# EAGLE board Hornet UFC 020a (EAGLE 9.2.2)
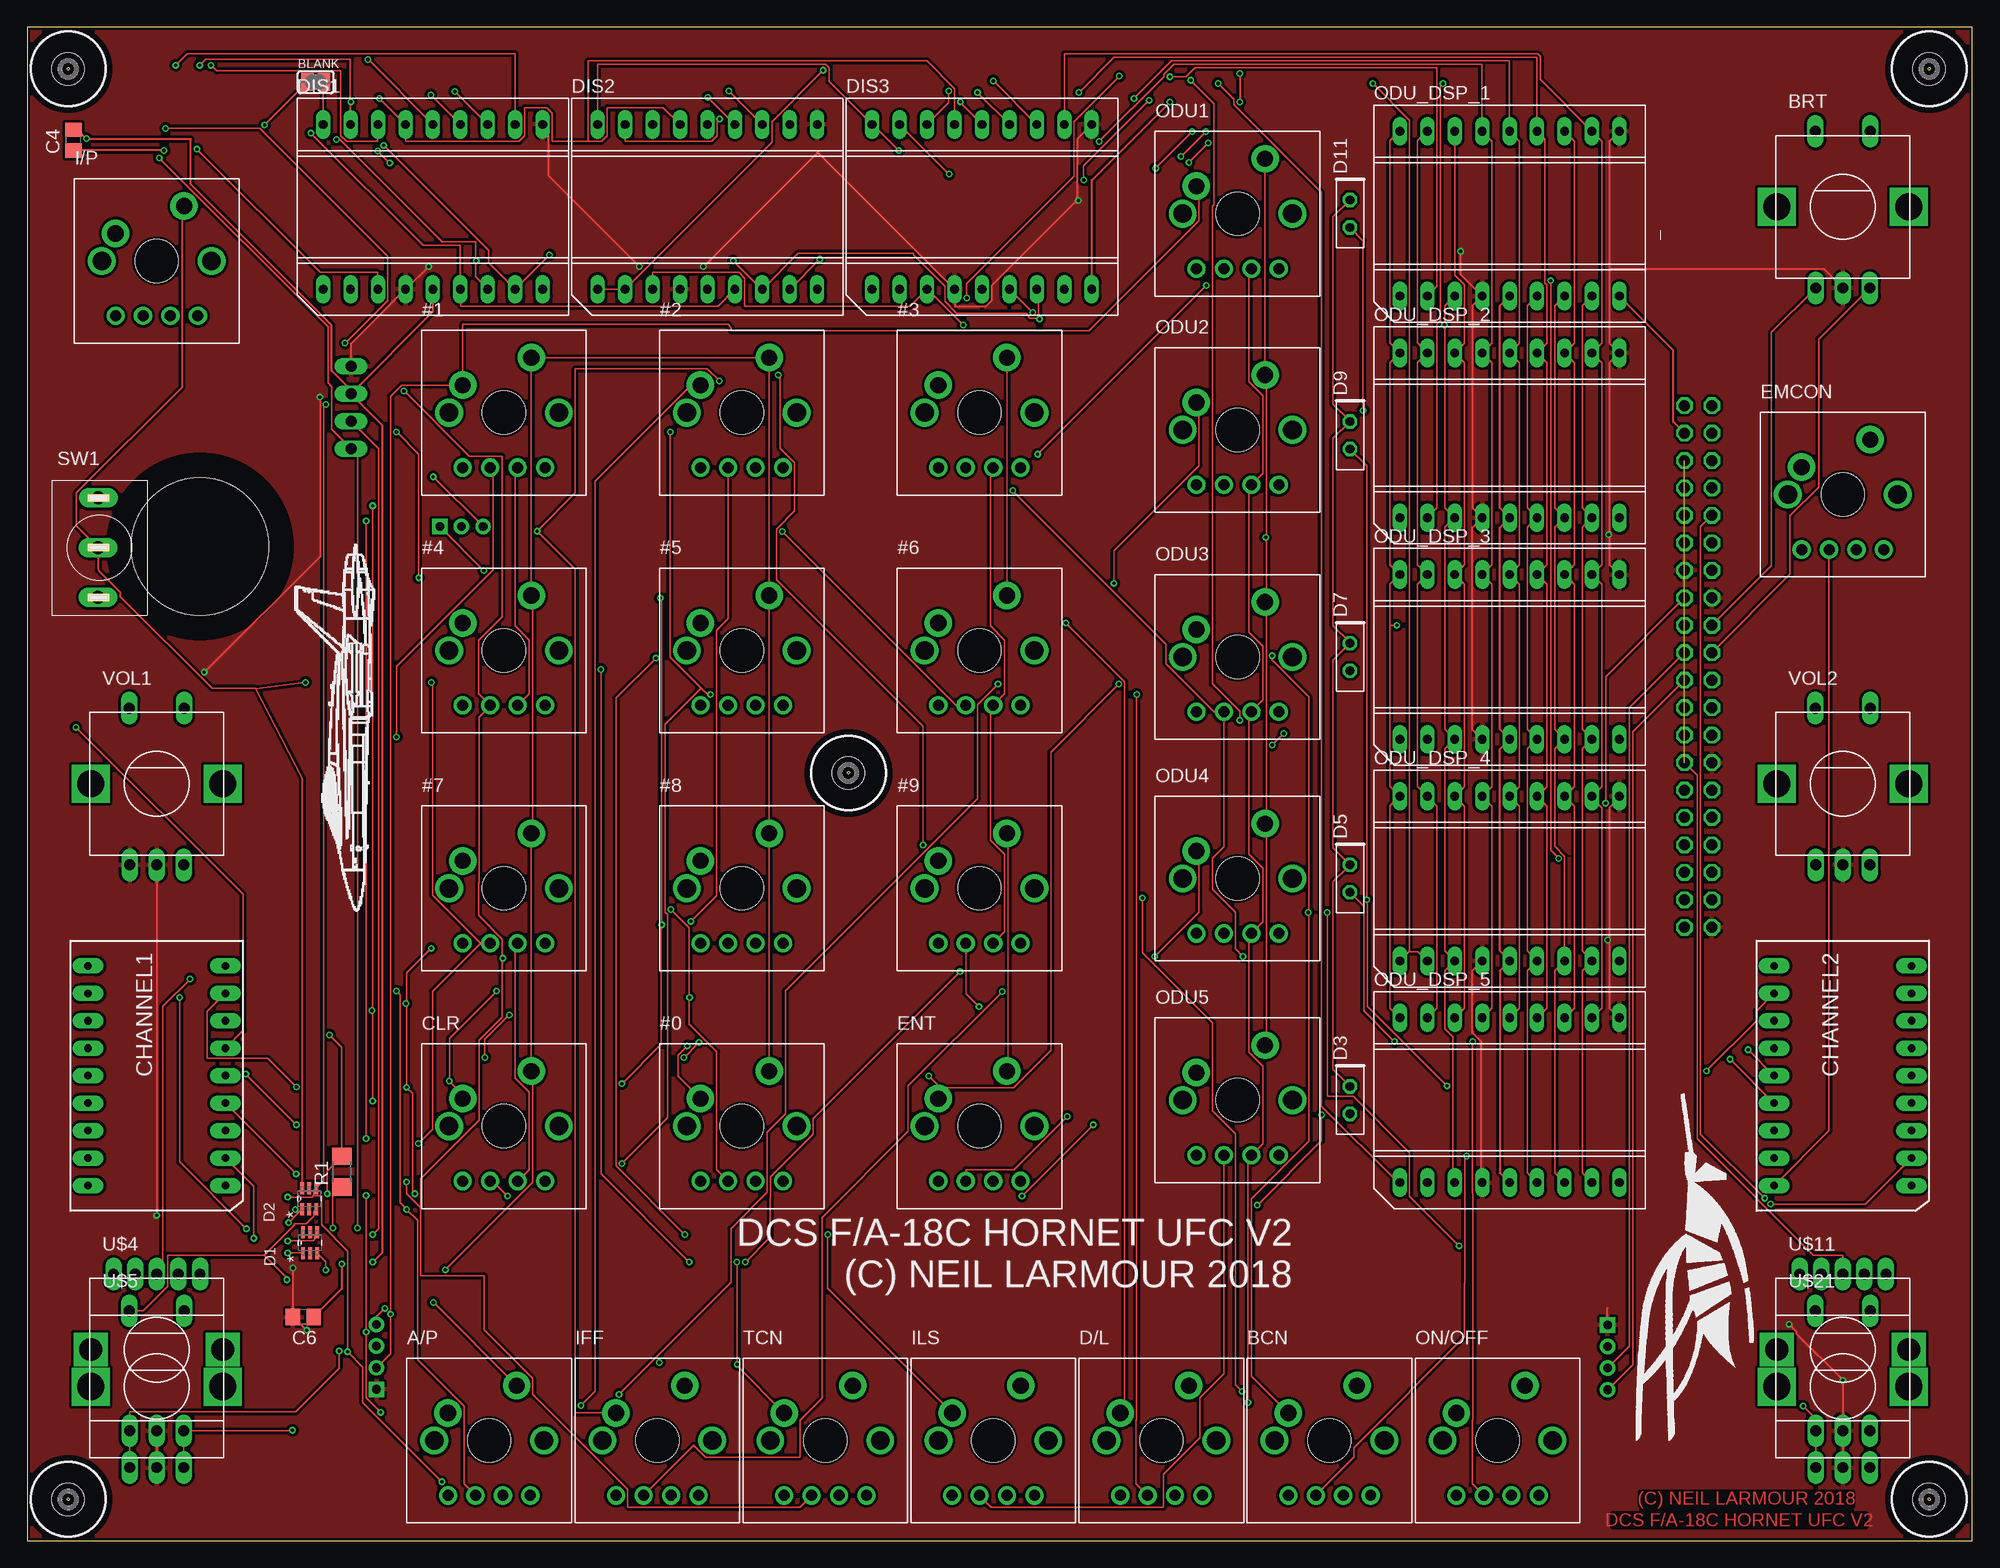
[diagram p7: board, top side]
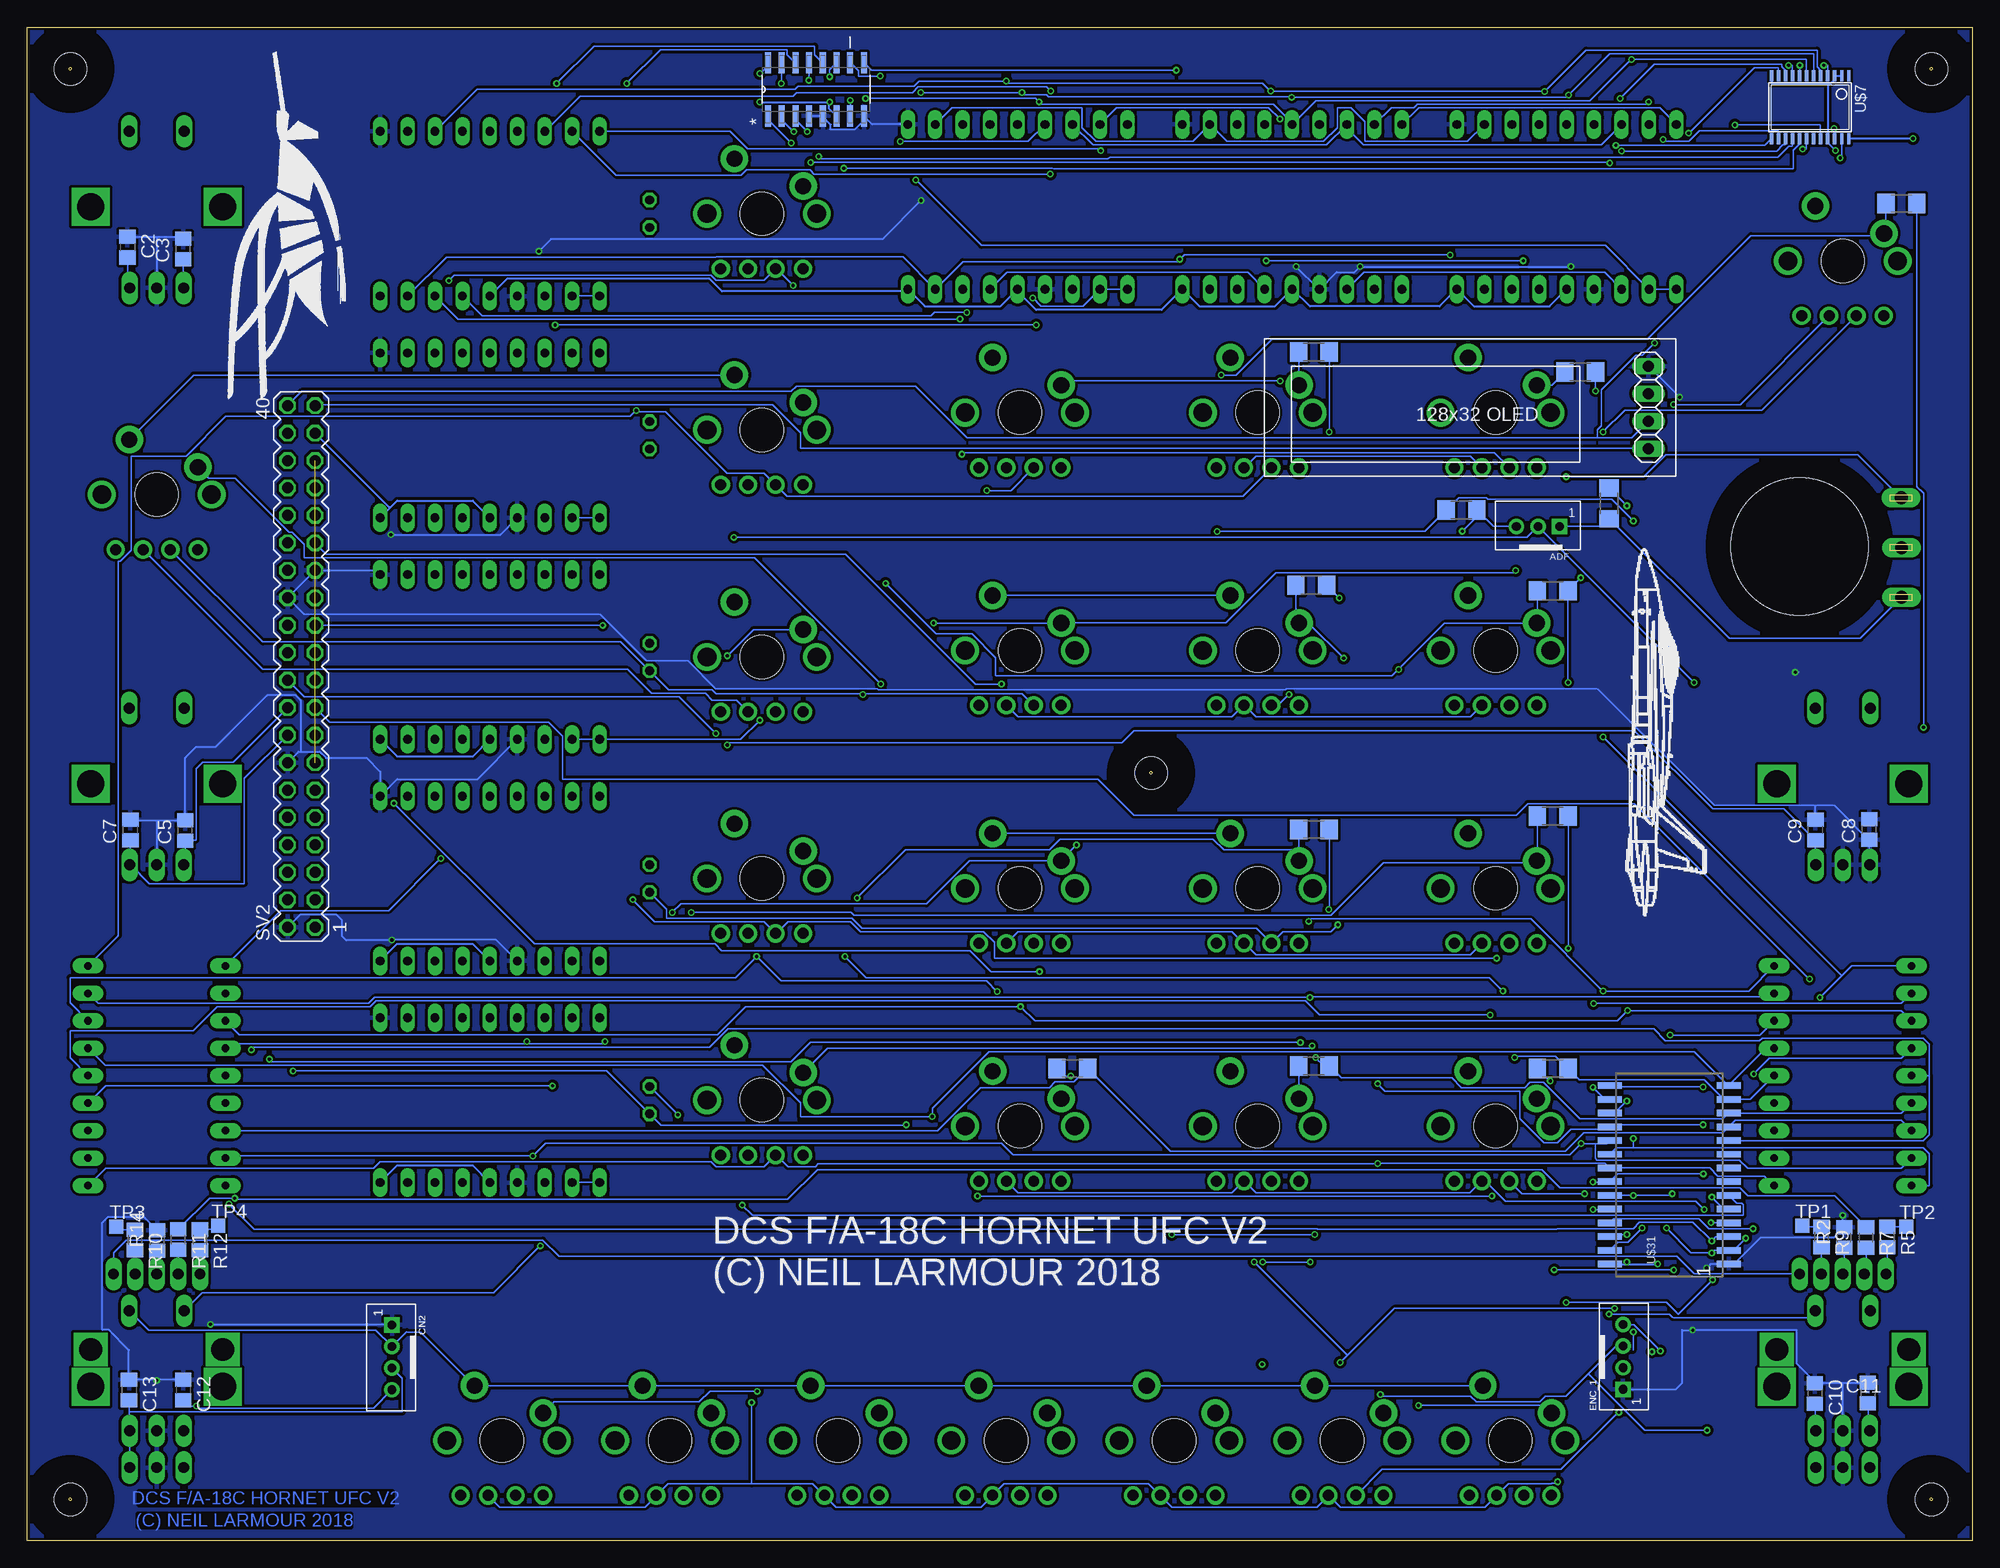
[diagram p8: board, bottom side, seen from below]

Size 180 x 140 mm. Coordinates in mm from the lower left corner, seen from the top.
Outline: 0,0 180,0 180,140 0,140 0,0
Copper layers (1*16): Top 0.035mm / dielectric 1.5mm / Bottom 0.035mm
Design rules "SeeedStudio_2layer_DRU_no_angle_20140221": minimum track width 6mil, minimum drill 12mil, track to track 6mil, track to pad 6mil, pad to pad 6mil, via to via 6mil, smd to smd 0mil, copper to edge 10mil, drill to drill 10mil, minimum pad ring 10mil, minimum via ring 6mil, stop-mask expansion 2mil, vias tented up to drill 100mil, thermal gap 10mil
Net classes: 1 power: width 0.2 mm
Holes 12.7 mm at 16,91.95
tKeepout: area 8.6,84.5 to 23.4,99.4
bKeepout: area 8.6,84.5 to 23.4,99.4
tRestrict: area 8.6,84.5 to 23.4,99.4
bRestrict: area 8.6,84.5 to 23.4,99.4

## Footprints (pad centres in the part's own frame; a part is rotated, then mirrored left to right if it is on the bottom)
SOIC127P600X175-16N = smd 1.981 x 0.559: 1 -2.464,4.445; 2 -2.464,3.175; 3 -2.464,1.905; 4 -2.464,0.635; 5 -2.464,-0.635; 6 -2.464,-1.905; 7 -2.464,-3.175; 8 -2.464,-4.445; 9 2.464,-4.445; 10 2.464,-3.175; 11 2.464,-1.905; 12 2.464,-0.635; 13 2.464,0.635; 14 2.464,1.905; 15 2.464,3.175; 16 2.464,4.445
GATERON-LED = drill 1.016 pad 1.676: LED1 -3.81,-5.08; LED2 3.81,-5.08; LED_ANODE -1.27,-5.08; LED_CATHODE 1.27,-5.08 | drill 1.714 pad 1.93: P$3 -5.08,0; P$4 5.08,0 | drill 1.5 pad 2.54: SW1 -3.81,2.54; SW2 2.54,5.08 | hole 4: 0,0
B3B-PH-SOLDER = drill 0.8 pad 1.422 square: P1 -2.98,0.588 | drill 0.8 pad 1.422: P2 -0.98,0.588; P3 1.02,0.588
SOLDERJUMPER_CLOSEDWIRE = smd 1.168 x 1.6: 1 -0.762,0; 2 0.762,0 | smd 0.635 x 0.203: WIRE 0,0
ENCODER+SWITCH_LARGER_TABS = drill 1 long: A -2.5,-7.5; B 2.5,-7.5; C 0,-7.5; D -2.54,7; E 2.54,7 | drill 2.5 square: GND1 -6.1,0; GND2 6.1,0
C0805 = smd 1.3 x 1.5: 1 -0.95,0; 2 0.95,0
PSC05-11 = drill 0.7 pad 1.422 long: 1 -6.35,10.16; 2 -6.35,7.62; 3 -6.35,5.08; 4 -6.35,2.54; 5 -6.35,0; 6 -6.35,-2.54; 7 -6.35,-5.08; 8 -6.35,-7.62; 9 -6.35,-10.16; 10 6.35,-10.16; 11 6.35,-7.62; 12 6.35,-5.08; 13 6.35,-2.54; 14 6.35,0; 15 6.35,2.54; 16 6.35,5.08; 17 6.35,7.62; 18 6.35,10.16
B4B-PH-SOLDER = drill 0.8 pad 1.422 square: P1 -2.98,0.588 | drill 0.8 pad 1.422: P2 -0.98,0.588; P3 1.02,0.588; P4 3.02,0.588
SSOT6 = smd 1.118 x 0.356: 1 -0.965,0.66; 2 -0.965,0; 3 -0.965,-0.66; 4 0.965,-0.66; 5 0.965,0; 6 0.965,0.66
LED5X2MM_RECT_3MM_VOFFSET = drill 0.813 octagon: A -1.27,0; K 1.27,0
HDLX2416(SOCKETED) = drill 0.813 long: 1 -10.16,-7.62; 2 -7.62,-7.62; 3 -5.08,-7.62; 4 -2.54,-7.62; 5 0,-7.62; 6 2.54,-7.62; 7 5.08,-7.62; 8 7.62,-7.62; 9 10.16,-7.62; 10 10.16,7.62; 11 7.62,7.62; 12 5.08,7.62; 13 2.54,7.62; 14 0,7.62; 15 -2.54,7.62; 16 -5.08,7.62; 17 -7.62,7.62; 18 -10.16,7.62
R1206 = smd 1.6 x 1.803: 1 -1.422,0; 2 1.422,0
R0805 = smd 1.3 x 1.5: 1 -0.95,0; 2 0.95,0
MA20-2 = drill 1.016 octagon: 1 -24.13,-1.27; 2 -24.13,1.27; 3 -21.59,-1.27; 4 -21.59,1.27; 5 -19.05,-1.27; 6 -19.05,1.27; 7 -16.51,-1.27; 8 -16.51,1.27; 9 -13.97,-1.27; 10 -13.97,1.27; 11 -11.43,-1.27; 12 -11.43,1.27; 13 -8.89,-1.27; 14 -8.89,1.27; 15 -6.35,-1.27; 16 -6.35,1.27; 17 -3.81,-1.27; 18 -3.81,1.27; 19 -1.27,-1.27; 20 -1.27,1.27; 21 1.27,-1.27; 22 1.27,1.27; 23 3.81,-1.27; 24 3.81,1.27; 25 6.35,-1.27; 26 6.35,1.27; 27 8.89,-1.27; 28 8.89,1.27; 29 11.43,-1.27; 30 11.43,1.27; 31 13.97,-1.27; 32 13.97,1.27; 33 16.51,-1.27; 34 16.51,1.27; 35 19.05,-1.27; 36 19.05,1.27; 37 21.59,-1.27; 38 21.59,1.27; 39 24.13,-1.27; 40 24.13,1.27
MICRO_TOGGLE_SPDT = drill 1.2 long: A$1 0,4.6; B$1 -0.04,-4.6; C$1 -0.04,0
TP13SQ = smd 1.3 x 1.3: TP 0,0
DRIL-3 = hole 3: 0,0
ENCODER_RGB = drill 1 long: A -2.5,-7.5; B 2.5,-7.5; C 0,-7.5 | drill 1 pad 1.27 long: ANODE 4,7; BLUE 2,7; GREEN -2,7; RED -4,7; SWITCH 0,7 | drill 2.1 square: GND1 -6.1,0; GND2 6.1,0
TSSOP24 = smd 0.305 x 0.991: 1 -3.575,-2.918; 2 -2.925,-2.918; 3 -2.275,-2.918; 4 -1.625,-2.918; 5 -0.975,-2.918; 6 -0.325,-2.918; 7 0.325,-2.918; 8 0.975,-2.918; 9 1.625,-2.918; 10 2.275,-2.918; 11 2.925,-2.918; 12 3.575,-2.918; 13 3.575,2.918; 14 2.925,2.918; 15 2.275,2.918; 16 1.625,2.918; 17 0.975,2.918; 18 0.325,2.918; 19 -0.325,2.918; 20 -0.975,2.918; 21 -1.625,2.918; 22 -2.275,2.918; 23 -2.925,2.918; 24 -3.575,2.918
SOIC28 = smd 0.6 x 2.2: 1 -7.62,-5.5; 2 -6.35,-5.5; 3 -5.08,-5.5; 4 -3.81,-5.5; 5 -2.54,-5.5; 6 -1.27,-5.5; 7 0,-5.5; 8 1.27,-5.5; 9 2.54,-5.5; 10 3.81,-5.5; 11 5.08,-5.5; 12 6.35,-5.5; 13 7.62,-5.5; 14 8.89,-5.5; 15 8.89,5.5; 16 7.62,5.5; 17 6.35,5.5; 18 5.08,5.5; 19 3.81,5.5; 20 2.54,5.5; 21 1.27,5.5; 22 0,5.5; 23 -1.27,5.5; 24 -2.54,5.5; 25 -3.81,5.5; 26 -5.08,5.5; 27 -6.35,5.5; 28 -7.62,5.5
OLED128X32_GRAPHICS_MODULE = drill 1.016 long: 1 -16.51,-3.81; 2 -16.51,-1.27; 3 -16.51,1.27; 4 -16.51,3.81

## Placement (x,y rotation side)
74HC138  CD74HC138M  [SOIC127P600X175-16N]  107.01,134.24 90 bottom
#0  GATERON-LED  [GATERON-LED]  66.12,38.33 0 top
#1  GATERON-LED  [GATERON-LED]  44.12,104.33 0 top
#2  GATERON-LED  [GATERON-LED]  66.12,104.33 0 top
#3  GATERON-LED  [GATERON-LED]  88.12,104.33 0 top
#4  GATERON-LED  [GATERON-LED]  44.12,82.33 0 top
#5  GATERON-LED  [GATERON-LED]  66.12,82.33 0 top
#6  GATERON-LED  [GATERON-LED]  88.12,82.33 0 top
#7  GATERON-LED  [GATERON-LED]  44.12,60.33 0 top
#8  GATERON-LED  [GATERON-LED]  66.12,60.33 0 top
#9  GATERON-LED  [GATERON-LED]  88.12,60.33 0 top
A/P  GATERON-LED  [GATERON-LED]  42.76,9.25 0 top
ADF  ADF  [B3B-PH-SOLDER]  41.18,94.38 180 bottom
BCN  GATERON-LED  [GATERON-LED]  120.51,9.25 0 top
BLANK  [SOLDERJUMPER_CLOSEDWIRE]  26.71,134.9 0 top
BRT  ALPS_ENCODER+PUSHSWITCHLARGE_TABS  [ENCODER+SWITCH_LARGER_TABS]  168,123.36 0 top
C2  100nF  [C0805]  170.71,119.63 270 bottom
C3  100nF  [C0805]  165.56,119.48 90 bottom
C4  0.1uF  [C0805]  4.29,129.53 90 top
C5  100nF  [C0805]  165.35,65.67 90 bottom
C6  0.1uF  [C0805]  25.55,20.67 180 top
C7  100nF  [C0805]  170.43,65.72 90 bottom
C8  100nF  [C0805]  9.55,65.77 90 bottom
C9  100nF  [C0805]  14.53,65.74 90 bottom
C10  100nF  [C0805]  14.58,13.61 270 bottom
C11  100nF  [C0805]  9.68,13.66 270 bottom
C12  100nF  [C0805]  165.56,13.94 270 bottom
C13  100nF  [C0805]  170.56,13.94 270 bottom
CHANNEL1  16-SEG_THROUGH_HOLEPSC05-11  [PSC05-11]  12,43 0 top
CHANNEL2  16-SEG_THROUGH_HOLEPSC05-11  [PSC05-11]  168,43 0 top
CLR  GATERON-LED  [GATERON-LED]  44.12,38.33 0 top
CN2  JST-PH-B4B-PH-SM4THRU-HOLE  [B4B-PH-SOLDER]  146.81,16.97 270 bottom
D1  BAT54CDW-7-F  [SSOT6]  26.18,27.55 90 top
D2  BAT54CDW-7-F  [SSOT6]  26.12,31.63 90 top
D3  [LED5X2MM_RECT_3MM_VOFFSET]  122.4,40.73 90 top
D5  [LED5X2MM_RECT_3MM_VOFFSET]  122.4,61.23 90 top
D7  [LED5X2MM_RECT_3MM_VOFFSET]  122.4,81.73 90 top
D9  [LED5X2MM_RECT_3MM_VOFFSET]  122.4,102.23 90 top
D11  [LED5X2MM_RECT_3MM_VOFFSET]  122.4,122.73 90 top
D/L  GATERON-LED  [GATERON-LED]  104.96,9.25 0 top
DIS1  HDLX2416SOCKETED  [HDLX2416(SOCKETED)]  37.55,123.36 0 top
DIS2  HDLX2416SOCKETED  [HDLX2416(SOCKETED)]  62.95,123.36 0 top
DIS3  HDLX2416SOCKETED  [HDLX2416(SOCKETED)]  88.35,123.36 0 top
EMCON  GATERON-LED  [GATERON-LED]  168,96.75 0 top
ENC_1  JST-PH-B4B-PH-SM4THRU-HOLE  [B4B-PH-SOLDER]  31.75,16.97 90 bottom
ENT  GATERON-LED  [GATERON-LED]  88.12,38.33 0 top
I/P  GATERON-LED  [GATERON-LED]  12,118.36 0 top
IFF  GATERON-LED  [GATERON-LED]  58.31,9.25 0 top
ILS  GATERON-LED  [GATERON-LED]  89.41,9.25 0 top
ODU1  GATERON-LED  [GATERON-LED]  112,122.73 0 top
ODU2  GATERON-LED  [GATERON-LED]  112,102.73 0 top
ODU3  GATERON-LED  [GATERON-LED]  112,81.73 0 top
ODU4  GATERON-LED  [GATERON-LED]  112,61.23 0 top
ODU5  GATERON-LED  [GATERON-LED]  112,40.73 0 top
ODU_DSP_1  HDLX2416SOCKETED  [HDLX2416(SOCKETED)]  137.18,122.73 0 top
ODU_DSP_2  HDLX2416SOCKETED  [HDLX2416(SOCKETED)]  137.18,102.23 0 top
ODU_DSP_3  HDLX2416SOCKETED  [HDLX2416(SOCKETED)]  137.18,81.73 0 top
ODU_DSP_4  HDLX2416SOCKETED  [HDLX2416(SOCKETED)]  137.18,61.23 0 top
ODU_DSP_5  HDLX2416SOCKETED  [HDLX2416(SOCKETED)]  137.18,40.73 0 top
ON/OFF  GATERON-LED  [GATERON-LED]  136.06,9.25 0 top
R1  39K  [R1206]  29.14,34.12 90 top
R2  10K  [R0805]  11.87,28.02 90 bottom
R5  [R0805]  7.87,28.09 270 bottom
R7  [R0805]  9.84,28.02 270 bottom
R9  [R0805]  13.97,28.09 270 bottom
R10  [R0805]  170.01,27.81 270 bottom
R11  [R0805]  166,27.83 270 bottom
R12  [R0805]  164.01,27.82 270 bottom
R14  10K  [R0805]  167.96,27.77 90 bottom
R49  39K  [R1206]  38.83,43.66 180 bottom
R50  39K  [R1206]  38.83,67.03 180 bottom
R51  39K  [R1206]  60.93,43.91 180 bottom
R52  39K  [R1206]  60.93,65.76 180 bottom
R53  39K  [R1206]  83.28,43.66 180 bottom
R54  39K  [R1206]  6.57,123.67 180 bottom
R55  39K  [R1206]  38.83,87.86 180 bottom
R56  39K  [R1206]  36.29,108.1 180 bottom
R57  39K  [R1206]  60.93,109.95 180 bottom
R58  39K  [R1206]  61.18,88.36 180 bottom
R59  39K  [R1206]  47.27,95.32 0 bottom
R60  39K  [R1206]  33.61,95.93 270 bottom
SV2  [MA20-2]  154.62,80.85 90 bottom
SW1  ADF_SMALL  [MICRO_TOGGLE_SPDT]  6.6,91.84 0 top
TCN  GATERON-LED  [GATERON-LED]  73.86,9.25 0 top
TP1  PTR1TP13SQ  [TP13SQ]  15.75,29.1 0 bottom
TP2  PTR1TP13SQ  [TP13SQ]  6.12,29.03 0 bottom
TP3  PTR1TP13SQ  [TP13SQ]  171.73,29.03 0 bottom
TP4  PTR1TP13SQ  [TP13SQ]  162.31,29.1 0 bottom
U$3  [DRIL-3]  76,71 0 top
U$4  ENC_RGB_L  [ENCODER_RGB]  12,17.66 0 top
U$5  ALPS_ENCODER+PUSHSWITCHLARGE_TABS  [ENCODER+SWITCH_LARGER_TABS]  12,14.25 0 top
U$7  PCF8575PWR  [TSSOP24]  15.02,132.58 180 bottom
U$11  ENC_RGB_R  [ENCODER_RGB]  168,17.66 0 top
U$21  ALPS_ENCODER+PUSHSWITCHLARGE_TABS  [ENCODER+SWITCH_LARGER_TABS]  168,14.25 0 top
U$25  [DRIL-3]  176,136.13 0 top
U$26  [DRIL-3]  3.81,3.81 0 top
U$31  Addr 0x71  [SOIC28]  28.05,33.19 90 bottom
U$34  [DRIL-3]  176,3.81 0 top
U$37  OLED_128X32_I2C_DISPLAYTHROUGH_HOLE  [OLED128X32_GRAPHICS_MODULE]  46.48,104.82 180 bottom
U$39  [DRIL-3]  3.81,136.13 0 top
VOL1  ALPS_ENCODER+PUSHSWITCHLARGE_TABS  [ENCODER+SWITCH_LARGER_TABS]  12,70 0 top
VOL2  ALPS_ENCODER+PUSHSWITCHLARGE_TABS  [ENCODER+SWITCH_LARGER_TABS]  168,70 0 top

## Tracks (layer width: path | path; a pad name or v marks a point on that pad's centre or on a via)
3.3V
  Bottom 0.152: U$11.ANODE 172,26.6 170.8,27.8 132.28,27.8 130.78,26.3 27.36,26.3 25.72,24.66 U$4.ANODE
5V  (via drill 0.3)
  Top 0.2: ODU_DSP_1.9 152.32,110.12 152.32,103.48 153.34,102.46 SV2.37 | ODU_DSP_1.5 136.26,114.2 136.26,95.52 137.16,94.62 ODU_DSP_2.5 136.26,93.7 136.26,75.06 137.12,74.2 ODU_DSP_3.5 136.26,73.2 136.26,54.56 137.12,53.7 ODU_DSP_4.5 136.26,52.7 136.26,34.02 137.16,33.12 ODU_DSP_5.5 | v112.2,135.7 v112.2,133.06 | v105.74,133.06 98.52,125.84 98.52,115.76 DIS3.9 | v29.12,25.58 29.12,23.28 26.52,20.68 C6.1 | C4.2 4.3,130.46 4.72,130.46 v5.5,129.68 5.58,129.62 15.16,129.62 15.16,125.44 28.18,112.42 28.18,108.2 30.06,106.32 U$37.2 | U$37.2 37.54,113.66 DIS1.5 | v31.98,25.76 32.86,26.64 32.86,103.16 30.02,106 U$37.2
  Bottom 0.2: ODU_DSP_2.5 138.76,96.2 145.74,96.2 146.41,95.53 | 146.41,95.53 147.32,94.62 ODU_DSP_2.9 | SV2.37 146.5,95.6 146.48,95.6 146.41,95.53 | ODU_DSP_3.9 145.76,72.54 138.74,72.54 ODU_DSP_3.5 | ODU_DSP_5.5 138.76,34.7 145.74,34.7 147.32,33.12 ODU_DSP_5.9 | ODU_DSP_4.5 138.76,55.2 145.74,55.2 147.32,53.62 ODU_DSP_4.9 | 105.84,133.06 105.84,132.5 105.12,131.78 74HC138.6 | v112.2,133.06 105.84,133.06 | v112.2,135.7 111.46,136.44 111.46,136.68 74HC138.16 | v105.74,133.06 105.84,133.06 | 31.98,25.58 U$31.28 | 31.98,25.58 v29.12,25.58 | v5.5,129.68 11.44,129.68 U$7.24 | DIS1.5 39.14,114.16 46.12,114.16 DIS1.9 47.78,115.68 49.3,114.16 61.3,114.16 62.86,115.72 DIS2.5 64.54,114.16 71.52,114.16 DIS2.9 73.18,115.68 75.02,113.84 86.64,113.84 88.38,115.58 DIS3.5 89.94,114.16 96.92,114.16 DIS3.9 98.44,115.54 115.7,115.54 116.86,116.7 135.58,116.7 137.16,115.12 ODU_DSP_1.5 | v31.98,25.76 31.98,25.58
COM_1_0  (via drill 0.3)
  Top 0.152: v24.12,26.6 25.52,26.6 D1.1 | v28.3,28.9 28.3,31.84 R1.1 | v20.98,27.96 20.98,32.76 CHANNEL1.11
  Bottom 0.152: v28.3,28.9 26.04,26.64 24.18,26.64 v24.12,26.6 23.88,26.84 U$31.2 22.48,26.84 22.1,26.84 v20.98,27.96
COM_1_1  (via drill 0.3)
  Top 0.152: v24.12,27.72 26.46,27.72 26.6,27.86 26.6,28.26 26.84,28.5 D1.4 | v161.32,31.12 170.08,31.12 CHANNEL2.11
  Bottom 0.152: U$31.3 23.74,28.1 v24.12,27.72 24.18,27.76 25.86,29.44 30.8,29.44 31.4,28.84 38.43,28.84 38.47,28.8 60.61,28.8 60.64,28.83 74.3,28.83 74.33,28.8 159,28.8 v161.32,31.12
COM_1_2  (via drill 0.3)
  Top 0.152: v24.2,29.4 25.11,30.31 | 25.11,30.31 D2.1 | 25.11,30.31 24.82,30.6 v24.82,30.62 | #3.LED_CATHODE 89.16,99.02 89.16,84.6 90.46,83.3 90.46,78.32 #6.LED_CATHODE 89.34,77.2 89.16,77.02 89.16,64.78 90.46,63.48 90.46,56.32 #9.LED_CATHODE | #1.LED_CATHODE 45.38,99.24 45.16,99.02 45.16,84.6 46.46,83.3 46.46,78.32 #4.LED_CATHODE | CLR.LED_CATHODE 46.46,34.32 46.46,41.48 45.16,42.78 45.16,55.02 45.38,55.24 #7.LED_CATHODE
  Bottom 0.152: v24.2,29.4 22.56,29.4 U$31.4 | v24.82,30.62 25.58,31.38 43.22,31.38 45.08,33.24 45.38,33.24 CLR.LED_CATHODE 45.46,33.22 46.5,32.18 66.32,32.18 #0.LED_CATHODE 67.46,33.22 68.5,32.18 88.32,32.18 ENT.LED_CATHODE | #7.LED_CATHODE 46.46,54.18 66.32,54.18 #8.LED_CATHODE 67.46,55.28 68.5,56.32 88.32,56.32 #9.LED_CATHODE | #1.LED_CATHODE 46.46,100.32 66.32,100.32 #2.LED_CATHODE | #4.LED_CATHODE 46.46,76.18 66.32,76.18 #5.LED_CATHODE 67.46,77.22 68.5,76.18 88.32,76.18 #6.LED_CATHODE
COM_1_3  (via drill 0.3)
  Top 0.152: 26.54,31.94 26.54,32.34 D2.4 26.82,32.66 27.44,33.28 27.44,104.86 v27.66,105.08 | 26.54,31.94 26.36,31.76 v24.12,31.76 | ODU1.LED_CATHODE 113.26,117.64 113.04,117.42 113.04,107.18 114.34,105.88 114.34,98.72 ODU2.LED_CATHODE 113.26,97.58 113.04,97.36 113.04,84 114.34,82.7 114.34,77.76 113.3,76.72 ODU3.LED_CATHODE 113.26,76.64 113.04,76.42 113.04,63.5 114.34,62.2 114.34,57.26 113.3,56.22 ODU4.LED_CATHODE 113.26,56.14 113.04,55.92 113.04,45.18 114.34,43.88 114.34,36.72 ODU5.LED_CATHODE 113.22,35.6 112.96,35.34 v112.96,12.76 | 26.54,31.94 26.6,31.9 27.24,31.9 27.24,29.2 29.66,26.78 v29.66,17.46 29.7,17.4 31.06,16.04 31.06,12.76 v38.38,5.44
  Bottom 0.152: v24.12,31.76 23.02,30.66 U$31.5 | v27.66,105.08 21.48,105.08 I/P.LED_CATHODE | 112.96,5.24 107.34,5.24 106.3,4.2 D/L.LED_CATHODE 105.16,3.1 91.72,3.1 90.72,4.1 ILS.LED_CATHODE 90.66,4.18 89.6,5.24 76.24,5.24 75.2,4.2 TCN.LED_CATHODE 74.06,3.1 60.66,3.1 59.64,4.12 IFF.LED_CATHODE 59.56,4.16 58.5,3.1 45.1,3.1 A/P.LED_CATHODE 43.96,4.2 42.92,5.24 38.98,5.24 38.92,5.28 38.54,5.28 v38.38,5.44 | 112.96,5.24 120.7,5.24 121.76,4.18 BCN.LED_CATHODE 121.82,4.1 122.82,3.1 136.26,3.1 ON/OFF.LED_CATHODE | EMCON.LED_CATHODE 158.18,80.58 124.44,80.58 122.22,78.36 117.24,78.36 116.62,77.74 114.36,77.74 ODU3.LED_CATHODE | v112.96,12.76 112.96,5.24 | 29.66,17.14 v29.66,17.46
COM_1_4  (via drill 0.3)
  Top 0.152: D11.K 120.84,122.44 120.84,105.12 122.38,103.58 D9.K 120.84,101.94 120.84,84.62 122.38,83.08 D7.K 120.84,81.44 120.84,64.08 D5.K 122.36,62.44 120.84,60.92 120.84,43.58 D3.K | v113.82,31.02 119.78,36.98 v119.78,39.38
  Bottom 0.152: v113.82,31.02 112.88,30.08 21.22,30.08 21.22,31.04 21.36,31.18 21.8,31.18 U$31.6 | v119.78,39.38 D3.K
D0  (via drill 0.3)
  Top 0.152: ODU_DSP_5.11 145.7,49.26 145.7,67.8 144.8,68.7 144.8,68.84 ODU_DSP_4.11 144.86,68.9 145.7,69.74 145.7,88.44 144.8,89.34 ODU_DSP_3.11 144.86,89.4 145.7,90.24 145.7,108.94 144.8,109.84 ODU_DSP_2.11 144.86,109.9 145.7,110.74 145.7,129.44 ODU_DSP_1.11 144.76,130.42 140,135.18 140,137.32 139.8,137.52 95.98,137.52 95.98,131 DIS3.11 | v13.76,136.46 14.84,137.54 45.16,137.54 45.16,131 DIS1.11
  Bottom 0.152: DIS3.11 95.96,131 94.42,132.54 82.38,132.54 82.38,130.7 81.1,129.42 72.14,129.42 DIS2.11 70.5,130.96 68.96,129.42 60.04,129.42 58.76,130.7 58.76,132.54 57.5,132.54 56.22,131.26 56.22,129.42 46.74,129.42 DIS1.11 | v13.76,136.46 13.4,136.46 U$7.4
D1  (via drill 0.3)
  Top 0.152: ODU_DSP_5.12 143.16,49.26 143.16,67.94 142.26,68.84 ODU_DSP_4.12 142.32,68.9 143.16,69.74 143.16,88.44 142.26,89.34 ODU_DSP_3.12 142.32,89.4 143.16,90.24 143.16,108.94 142.26,109.84 ODU_DSP_2.12 142.32,109.9 143.16,110.74 143.16,129.44 ODU_DSP_1.12 | v39.58,134.04 42.62,131 DIS1.12 | v64.94,134.08 68.02,131 DIS2.12 | v89.4,135.02 93.42,131 DIS3.12
  Bottom 0.152: U$7.5 14.06,136 14.38,136.32 14.38,137.86 35.76,137.86 v39.58,134.04 39.64,134.08 v64.94,134.08 65,134.12 65.68,134.8 89.18,134.8 v89.4,135.02 89.46,134.98 97.48,134.98 97.92,134.54 108.64,134.54 108.94,134.24 138.36,134.24 142.24,130.36 ODU_DSP_1.12
D2  (via drill 0.3)
  Top 0.152: v37.36,133.72 40.08,131 DIS1.13 | v62.98,133.5 65.48,131 DIS2.13 | v87.94,133.94 90.88,131 DIS3.13 | ODU_DSP_5.13 140.62,49.26 140.62,67.94 139.72,68.84 ODU_DSP_4.13 139.78,68.9 140.62,69.74 140.62,88.44 139.72,89.34 ODU_DSP_3.13 139.78,89.4 140.62,90.24 140.62,108.94 139.72,109.84 ODU_DSP_2.13 139.78,109.9 140.62,110.74 140.62,116.14 140.44,116.32 140.44,129.62 ODU_DSP_1.13 139.68,130.42 139.68,137.2 100.58,137.2 v97.32,133.94
  Bottom 0.152: U$7.6 14.7,137.54 33.54,137.54 v37.36,133.72 37.42,133.68 37.6,133.5 v62.98,133.5 63.04,133.54 85.5,133.54 85.68,133.72 87.72,133.72 v87.94,133.94 v97.32,133.94
D3  (via drill 0.3)
  Top 0.152: v31.54,137 37.54,131 DIS1.14 | v86.36,133.08 86.36,132.98 88.34,131 DIS3.14 | ODU_DSP_5.14 138.08,49.26 138.08,67.94 137.18,68.84 ODU_DSP_4.14 137.24,68.9 138.08,69.74 138.08,88.44 137.18,89.34 ODU_DSP_3.14 137.24,89.4 138.08,90.24 138.08,108.94 137.18,109.84 ODU_DSP_2.14 137.24,109.9 138.08,110.74 138.08,129.44 ODU_DSP_1.14 137.14,130.42 137.14,136.88 105.9,136.88 v102.42,133.4
  Bottom 0.152: U$7.7 15.36,137 v31.54,137 31.6,136.96 35.38,133.18 60.76,133.18 62.94,131 DIS2.14 62.92,131.12 64.66,132.86 86.14,132.86 v86.36,133.08 86.42,133.12 86.7,133.4 v102.42,133.4
D4  (via drill 0.3)
  Top 0.152: v15.98,136.46 16.52,137 29.92,137 29.92,133.08 | 29.92,133.08 29.92,131 DIS1.17 | v29.98,133.08 29.92,133.08 | v64.08,131.5 63.84,131.26 63.84,129.94 63.32,129.42 55.34,129.42 DIS2.17 | ODU_DSP_5.17 130.46,49.26 130.46,67.94 129.56,68.84 ODU_DSP_4.17 129.52,68.92 128.66,69.78 128.66,88.46 ODU_DSP_3.17 129.52,89.42 128.66,90.28 128.66,108.96 ODU_DSP_2.17 129.52,109.92 128.66,110.78 128.66,129.46 ODU_DSP_1.17 | v85.32,126.4 DIS3.17
  Bottom 0.152: v15.98,136.46 15.98,135.5 U$7.8 | v29.98,133.08 30.2,132.86 51.36,132.86 51.68,132.54 53.78,132.54 55.32,131 DIS2.17 | v64.08,131.5 65.12,132.54 79.18,132.54 80.72,131 DIS3.17 | v85.32,126.4 107.18,126.4 107.56,126.78 113.44,126.78 113.92,126.3 125.5,126.3 ODU_DSP_1.17
D5  (via drill 0.3)
  Top 0.152: v17.02,136.46 17.54,135.94 29.04,135.94 29.04,129.94 29.56,129.42 32.46,129.42 DIS1.16 | ODU_DSP_5.16 133,49.26 133,67.94 132.1,68.84 ODU_DSP_4.16 132.16,68.9 133,69.74 133,88.44 132.1,89.34 ODU_DSP_3.16 132.16,89.4 133,90.24 133,108.94 132.1,109.84 ODU_DSP_2.16 132.16,109.9 133,110.74 133,116.14 132.1,117.04 ODU_DSP_1.16 | v85.28,134.08 85.28,133 83.28,131 DIS3.16
  Bottom 0.152: v17.02,136.46 16.66,136.46 U$7.9 | DIS3.16 81.38,129.1 59.76,129.1 DIS2.16 58,130.76 56.34,129.1 34.36,129.1 DIS1.16 | v85.28,134.08 85.68,134.48 97.54,134.48 98.08,133.94 108.8,133.94 109.14,133.6 128.84,133.6 ODU_DSP_1.16
D6  (via drill 0.3)
  Top 0.152: v32.6,133.4 35,131 DIS1.15 35.04,130.92 35.04,129.42 45.54,129.42 46.06,129.94 46.06,132.54 48.08,132.54 48.6,132.02 48.6,129.42 51.9,129.42 | 51.9,129.42 53.16,129.42 53.68,129.94 53.68,132.54 58.86,132.54 60.4,131 DIS2.15 | 51.9,129.42 51.9,136.86 83.26,136.86 85.82,134.3 85.82,131 DIS3.15 | ODU_DSP_5.15 135.54,49.26 135.54,67.94 134.64,68.84 ODU_DSP_4.15 134.7,68.9 135.54,69.74 135.54,88.44 134.64,89.34 ODU_DSP_3.15 134.7,89.4 135.54,90.24 135.54,108.94 134.64,109.84 ODU_DSP_2.15 134.7,109.9 135.54,110.74 135.54,129.44 ODU_DSP_1.15 134.6,130.42 134.6,136.56 106.14,136.56 105.2,135.62 105.2,135.42 v99.2,129.42
  Bottom 0.152: v32.6,133.4 29.44,136.56 17.64,136.56 17.64,136.32 17.3,135.98 U$7.10 | v99.2,129.42 87.38,129.42 DIS3.15
DSP3
  Top 0.152: SV2.22 155.9,82.14 163.12,89.36 163.12,94.8 165.76,97.44 165.76,111.12 BRT.B
  Bottom 0.152: C2.2 170.7,115.88 170.5,115.88 BRT.B
DSP_A0  (via drill 0.3)
  Top 0.152: ODU_DSP_5.8 144.78,33.12 143.9,34 143.9,52.72 ODU_DSP_4.8 144.76,53.68 143.9,54.54 143.9,73.22 ODU_DSP_3.8 144.76,74.18 143.9,75.04 143.9,93.72 ODU_DSP_2.8 144.76,94.68 143.9,95.54 143.9,114.22 ODU_DSP_1.8 | v73.34,118.52 70.58,115.76 DIS2.8 | v33,129.06 42.72,119.34 42.72,118.2 45.16,115.76 DIS1.8 45.22,115.8 v48.34,118.92
  Bottom 0.152: v33,129.06 19.2,129.06 U$7.13 | v48.34,118.92 72.92,118.92 73.28,118.56 v73.34,118.52 73.56,118.3 93.42,118.3 95.96,115.76 DIS3.8 96.02,115.8 98.96,118.74 116.24,118.74 116.26,118.72 141.18,118.72 144.78,115.12 ODU_DSP_1.8
DSP_A1  (via drill 0.3)
  Top 0.152: ODU_DSP_5.7 142.24,33.12 141.36,34 141.36,52.72 ODU_DSP_4.7 142.26,53.68 142.26,63.32 141.36,64.22 141.36,73.22 ODU_DSP_3.7 142.22,74.18 141.36,75.04 141.36,93.72 ODU_DSP_2.7 142.22,94.68 141.36,95.54 141.36,114.22 ODU_DSP_1.7 | 93.58,113.06 92.82,113.06 92.5,113.38 92.5,113.52 86.02,113.52 84.92,114.62 84.92,116.02 82.02,118.92 82.02,119.06 71.34,119.06 68.04,115.76 DIS2.7 67.96,115.76 v65.34,118.38 | 93.58,113.06 93.58,115.6 DIS3.7 | v28.62,129.6 28.94,129.6 38.42,120.12 41.5,120.12 41.5,118.38 | 41.5,118.38 41.5,116.88 42.62,115.76 DIS1.7 | v41.56,118.38 41.5,118.38 | v93.68,112.98 93.64,113.02 93.58,113.06
  Bottom 0.152: v28.62,129.6 28.44,129.42 26.26,129.42 25.28,130.4 17.96,130.4 17.96,129.68 U$7.14 | v41.56,118.38 v65.34,118.38 | ODU_DSP_1.7 140.12,112.98 v93.68,112.98
DSP_BL  (via drill 0.3)
  Top 0.152: BLANK.2 27.4,134.84 27.4,131 DIS1.18 | DIS2.18 52.8,131 52.8,136.54 73.88,136.54 74.2,136.22 74.2,134.98 78.18,131 DIS3.18 78.26,130.96 v80.66,128.56 | ODU_DSP_5.18 127,48.36 126.12,49.24 126.12,67.96 ODU_DSP_4.18 126.98,68.92 126.12,69.78 126.12,84.66 | 126.12,84.66 126.12,88.46 ODU_DSP_3.18 126.98,89.42 126.12,90.28 126.12,108.96 ODU_DSP_2.18 126.98,109.92 126.12,110.78 126.12,129.46 ODU_DSP_1.18 | 126.12,84.66 v126.74,84.66
  Bottom 0.152: DIS2.18 52.78,131 51.24,132.54 28.94,132.54 27.4,131 DIS1.18 | v126.74,84.66 SV2.23 | v80.66,128.56 80.82,128.72 113.32,128.72 114.94,130.34 127,130.34 ODU_DSP_1.18
DSP_CLR  (via drill 0.3)
  Top 0.152: v15.72,128.7 27.12,117.3 32.46,117.3 32.46,115.76 DIS1.3 | DIS2.3 57.88,115.76 57.88,117.3 65.86,117.3 66.38,116.78 66.38,114.18 81.7,114.18 DIS3.3 83.34,115.72 v86.62,112.44 | ODU_DSP_5.3 131.92,33.28 131.92,46.6 131.2,47.32 131.2,52.72 ODU_DSP_4.3 132.06,53.68 131.2,54.54 131.2,73.22 ODU_DSP_3.3 132.06,74.18 131.2,75.04 131.2,93.72 ODU_DSP_2.3 132.06,94.68 131.2,95.54 131.2,112.44 | ODU_DSP_1.3 131.2,114.22 131.2,112.44 | v131.14,112.44 131.2,112.44
  Bottom 0.152: v15.72,128.7 15.36,128.7 U$7.18 | DIS2.3 57.86,115.76 56.32,117.3 34.02,117.3 32.48,115.76 DIS1.3 | v131.14,112.44 v86.62,112.44
ENCODER_PWM  (via drill 0.3)
  Top 0.152: v160.78,31.66 154.84,37.6 154.84,93.78 SV2.32
  Bottom 0.152: R11.1 163.12,31.66 v160.78,31.66 160.72,31.62 160.66,31.56 109.64,31.56 106.88,34.32 39.86,34.32 38.16,32.62 21.52,32.62 20.8,31.9 12.76,31.9 R7.1
ENCODER_SW_L  (via drill 0.3)
  Top 0.152: v15.08,51.94 12.54,49.4 12.54,25.2 U$4.SWITCH
  Bottom 0.152: R2.1 11.88,24.66 U$4.SWITCH | v15.08,51.94 31.3,68.16 41.16,68.16 42.22,67.1 77.6,67.1 80.92,70.42 130.46,70.42 130.46,74.4 131.74,75.68 151.98,75.68 SV2.17
ENCODER_SW_R
  Top 0.152: 153.36,71.96 154.52,70.8 154.52,37.16 165.28,26.4 168,26.4 U$11.SWITCH
  Bottom 0.152: R14.1 167.96,24.66 U$11.SWITCH
ESP32_GPIO12  (via drill 0.3)
  Top 0.152: 31.92,19.58 32.32,19.98 ENC_1.P4 32.36,20.06 32.36,20.74 v33.1,21.48 | U$5.A U$4.A 9.5,11.9 24.86,11.9 24.9,11.96 28.88,15.94 v28.88,17.54 | v146.06,68.2 146.06,79.92 SV2.25 | v86.32,52.62 72.72,39.02 72.72,37.56 68.8,33.64 68.8,31.78 68.76,31.72 68.76,28.06 v66.46,25.76
  Bottom 0.152: C11.2 9.66,12.7 9.66,10.16 U$4.A | v146.06,68.2 133.04,55.18 116.36,55.18 115.74,54.56 92.76,54.56 90.82,52.62 v86.32,52.62 | 57.83,17.15 53.5,21.48 v33.1,21.48 | 57.83,17.15 v58.5,16.48 | v28.88,17.54 31.32,19.98 32.32,19.98 ENC_1.P4 | 57.83,17.15 66.44,25.76 v66.46,25.76
ESP32_GPIO13  (via drill 0.3)
  Top 0.152: U$5.B U$4.B 24.5,10.16 v24.56,10.2 | v89.84,79.22 87.94,77.32 87.94,68.62 70.18,50.86 70.18,39.46 68.48,37.76 68.48,32.22 68.44,32.16 65.14,28.86 65.14,23.88 v54.78,13.52
  Bottom 0.152: C10.2 14.56,12.66 14.56,10.16 U$4.B | v89.84,79.22 92.24,79.22 104.26,91.24 152.3,91.24 SV2.29 | v54.78,13.52 54.6,13.34 46.44,13.34 45.92,12.82 40.04,12.82 39.56,13.3 39.5,13.34 37.62,13.34 35.53,15.43 | ENC_1.P3 32.7,18.26 35.53,15.43 | 35.53,15.43 30.3,10.2 v24.56,10.2
ESP32_GPIO26  (via drill 0.3)
  Top 0.152: v164.34,12.44 165.5,11.28 U$11.A U$21.A | SV2.19 148.56,74.8 148.56,16.28 146.24,13.96 CN2.P4
  Bottom 0.152: C12.2 165.54,12.98 165,12.44 v164.34,12.44 164.28,12.4 164.14,12.26 147.92,12.26 146.24,13.94 CN2.P4
ESP32_GPIO27
  Top 0.152: SV2.21 148.24,77.02 148.24,17.96 146.24,15.96 CN2.P3
  Bottom 0.152: 170.56,11.9 170.56,10.16 U$11.B U$21.B | 170.56,11.9 C13.2 | 170.56,11.9 145.28,11.9 145.28,15 CN2.P3
GND  (via drill 0.3)
  Top 0.2: 146.42,117.64 146.42,129.44 ODU_DSP_1.10 | 146.42,117.64 146.42,110.76 147.32,109.86 ODU_DSP_2.10 146.42,108.94 146.42,93.04 | 146.42,93.04 146.42,90.26 147.32,89.36 ODU_DSP_3.10 | 146.42,117.64 166.24,117.64 168,115.88 BRT.C | v146.34,93.04 146.42,93.04 | 146.42,55.56 146.42,67.76 147.32,68.66 147.32,68.84 ODU_DSP_4.10 | 146.42,55.56 146.42,49.26 147.32,48.36 ODU_DSP_5.10 | U$21.C U$11.C v168,14.82 167.94,14.9 163.72,19.12 163.72,19.32 v163.04,20 | 146.22,21.52 CN2.P1 | ODU_DSP_4.4 133.72,52.7 133.72,46.98 134.58,46.12 134.58,33.2 ODU_DSP_5.4 | v146.24,55.56 146.42,55.56 | ODU_DSP_3.4 134.62,74.12 133.72,75.02 133.72,93.7 ODU_DSP_2.4 134.62,94.62 133.72,95.52 133.72,114.2 ODU_DSP_1.4 134.58,115.2 132.64,117.14 v132.64,119.26 | U$4.C U$5.C | v24.6,25.2 C6.2 24.7,20.64 v25.88,19.46 | 97.2,124.02 97.2,129.68 DIS3.10 | 97.2,124.02 89.28,116.1 89.28,114.72 88.72,114.16 85.86,114.16 85.86,115.66 DIS3.4 85.8,115.76 73.16,128.4 73.08,128.34 v62.58,117.84 | U$37.1 29.98,110.72 DIS1.4 35.1,115.78 v37.16,117.84 | v56.66,117.84 48.26,126.24 48.26,130.44 DIS1.10 | v16.4,80.32 27.1,91.02 v27.1,105.76 | v97.28,123.96 97.2,124.02 | VOL1.C v12,30.08
  Bottom 0.152: SV2.26 154.34,85.66 126.98,85.66 122.68,81.36 118.86,81.36 116.3,78.8 101.34,78.8 101.22,78.68 63.58,78.68 63.46,78.8 34.74,78.8 34.68,78.76 34.66,78.76 23.9,68 14.48,68 12.78,68 9.62,64.84 C8.1 9.54,64.8 9.54,62.5 VOL1.A
  Bottom 0.2: 168,120.58 C2.1 | 168,120.58 165.7,120.58 C3.2 | 168,120.58 BRT.C | ODU_DSP_3.10 147.72,89.74 SV2.27 | SV2.27 | v146.34,93.04 136.2,93.04 ODU_DSP_2.4 | 168,66.62 170.38,66.62 C7.2 | 168,66.62 C5.2 165.35,72.39 164.34,73.41 162.56,73.41 157.73,78.23 155.19,78.23 154.69,77.72 154.69,72.98 | 168,66.62 VOL2.C | 147.32,68.86 145.74,70.44 138.3,70.44 ODU_DSP_3.4 | 147.32,68.86 ODU_DSP_4.10 | 168,14.9 C13.1 170.58,15 170.58,17.62 172.44,19.48 173.02,19.48 173.02,29.4 172.48,29.94 169.18,29.94 R14.2 | 168,14.9 C12.1 | v168,14.82 168,14.9 | v163.04,20 163,19.96 146.24,19.96 CN2.P1 | ODU_DSP_4.4 136.58,55.56 v146.24,55.56 150.42,55.56 150.46,55.52 150.88,55.94 150.88,57.4 151.38,57.91 154.7,57.91 SV2.2 | 12,14.58 14.56,14.58 C10.1 14.58,14.68 16.28,16.38 16.28,19.48 25.8,19.48 v25.88,19.46 26.86,19.46 26.86,14.58 27.45,13.99 ENC_1.P1 | 12,14.58 9.7,14.58 C11.1 | U$4.C 12,14.58 | v24.6,25.2 24.24,25.56 U$31.1 22.46,25.6 22.02,25.6 19.58,28.04 12.8,28.04 R2.2 11.92,29.06 12,29.06 v12,30.08 | 74HC138.4 74HC138.5 106.34,131.68 105.64,130.98 105.64,130.52 103.42,130.52 102.44,131.5 74HC138.8 101.8,131 98.52,131 DIS3.10 | v37.16,117.84 37.18,117.82 56.58,117.82 v56.66,117.84 57.18,117.32 58.84,117.32 60.4,115.76 DIS2.4 60.5,115.78 60.52,115.78 v62.58,117.84 | v16.4,80.32 16.08,80.32 | v27.1,105.76 U$37.1 | v132.64,119.26 131.52,120.38 100.86,120.38 v97.28,123.96 | C9.2 14.53,67.95 14.48,68 | SV2.14 154.88,72.98 154.69,72.98 | 154.69,72.98 152.93,72.98 152.34,72.39 148.59,72.39 147.32,71.12 147.32,68.86 | SV2.26 SV2.27 | SV2.27
  pour Top (isolate 0.254): 0.25,-0.25 179.83,-0.25 179.83,139.95 0,139.95 0,-0.25
  pour Bottom (isolate 0.254): 0,0 180.09,0 180.09,139.95 0,139.95
I2C_0  (via drill 0.3)
  Top 0.152: v12.24,127.88 27.84,112.28 27.84,107.1 28.2,106.74 28.2,102.78 U$37.4 30,100.94 30.58,100.36 v30.58,28.9
  Bottom 0.152: v12.24,127.88 12.1,127.88 U$7.23 | v30.58,28.9 31.9,27.58 32.82,27.58 33.54,26.86 U$31.27 | SV2.39 153.34,105 153.26,105.08 111.04,105.08 108.44,102.48 108.44,101.02 U$37.4
I2C_1  (via drill 0.3)
  Top 0.152: v31.98,28.3 32.52,28.84 32.52,101 U$37.3 | v12.82,130.62 21.54,130.62 33.36,118.8 33.36,114.7 v29.42,110.76
  Bottom 0.152: v31.98,28.3 33.36,28.3 U$31.26 | 34.72,102 31.52,102 U$37.3 | 34.72,102 93.02,102 97.8,106.78 108.82,106.78 109.3,106.3 154.58,106.3 155.88,105 SV2.40 | v12.82,130.62 12.76,130.62 12.76,129.68 U$7.22 | v29.42,110.76 30.56,109.62 31.16,109.62 34.34,106.44 34.34,103.08 34.4,103.08 34.72,102.76 34.72,102
K3  (via drill 0.3)
  Top 0.152: ODU1.SW1 108.2,125.26 108.44,125.02 108.44,122.1 98.24,111.9 65.16,111.9 65.16,112.2 64.84,112.52 40.32,112.52 #1.SW1 40.24,106.88 34.66,106.88 33.64,105.86 v33.64,20.94 33.64,17.3 ENC_1.P2
  Bottom 0.152: U$5.E 15.16,20.62 27.7,20.62 27.76,20.66 28.04,20.94 v33.64,20.94 | R56.2 37.72,108.08 38.92,106.88 #1.SW1
K4  (via drill 0.3)
  Top 0.152: v51.26,12.5 52.56,13.8 52.56,98 61.42,106.86 #2.SW1
  Bottom 0.152: R57.2 62.34,106.88 #2.SW1 | v51.26,12.5 39.66,12.5 A/P.SW1
K5  (via drill 0.3)
  Top 0.152: v37.58,98.4 42.18,93.8 ADF.P3 | IFF.SW1 54.48,11.8 50.72,11.8 50.72,89.84 v47.2,93.36 47.24,93.42 50.72,96.9 50.72,108.38 62.94,108.38 v64.06,107.26
  Bottom 0.152: ADF.P3 44.34,93.8 45.84,95.3 R59.2 45.6,94.96 v47.2,93.36 | v37.58,98.4 30.4,98.4 28.36,100.44 10.62,100.44 6.62,96.44 SW1.A$1 | v64.06,107.26 83.92,107.26 #3.SW1
K6  (via drill 0.3)
  Top 0.152: v61.26,25.76 53.1,33.92 v53.1,80.58 | v100.56,88.54 100.56,91.54 108.44,99.42 108.44,105.02 108.2,105.26 ODU2.SW1 | v65.68,25.76 65.68,16.36 v65.72,16.3 65.72,16.12 TCN.SW1
  Bottom 0.152: R55.2 40.26,87.84 40.26,84.88 #4.SW1 40.38,84.84 48.84,84.84 v53.1,80.58 53.16,80.54 53.7,80 90.38,80 90.38,81.66 92.58,83.86 95.88,83.86 v100.56,88.54 | v61.26,25.76 v65.68,25.76
K7  (via drill 0.3)
  Top 0.152: v60.86,28.3 54.5,34.66 54.5,77.94 v58.18,81.62 | v74.08,28.3 74.08,23.32 85.54,11.86 85.54,11.85 ILS.SW1
  Bottom 0.152: R58.2 62.6,84.88 #5.SW1 62.24,84.86 61.42,84.86 v58.18,81.62 | v60.86,28.3 v74.08,28.3
K8  (via drill 0.3)
  Top 0.152: v96.12,84.86 101.54,79.44 101.54,12.18 D/L.SW1 | v42.26,89.72 ADF.P1
  Bottom 0.152: ADF.P1 38.18,93.8 34.32,93.8 R60.2 33.54,94.48 22.52,83.46 10.36,83.46 6.58,87.24 SW1.B$1 | v96.12,84.86 #6.SW1 84.24,84.88 69.06,84.88 64.44,89.5 42.48,89.5 v42.26,89.72
K9  (via drill 0.3)
  Top 0.152: 118.6,58.1 118.6,78.06 115.2,81.46 v115.2,81.84 | 118.6,58.1 118.6,36.92 113.28,31.6 113.28,15.2 116.68,11.8 BCN.SW1 | v118.54,58.1 118.6,58.1
  Bottom 0.152: R50.2 40.26,62.88 #7.SW1 40.38,62.84 40.54,62.68 54.5,62.68 59.36,57.82 103.5,57.82 103.78,58.1 v118.54,58.1 | v115.2,81.84 112.78,84.26 108.2,84.26 ODU3.SW1
K10  (via drill 0.3)
  Top 0.152: v112.42,13.8 111.8,14.42 111.8,37.62 109.66,39.76 109.66,42.62 109.7,42.66 109.7,47.88 103.2,54.38 v103.2,59.44
  Bottom 0.152: R52.2 62.34,65.74 62.34,62.88 #8.SW1 62.4,63.9 69.28,63.9 70.26,64.88 84.44,64.88 85.42,63.9 98.74,63.9 v103.2,59.44 | v112.42,13.8 116.82,13.8 117.8,12.82 131.22,12.82 ON/OFF.SW1
K11  (via drill 0.3)
  Top 0.152: v132.5,27.26 127.92,31.84 127.92,35.88 122.7,41.1 120.3,41.1 v120.3,58.1 | v69.5,107.8 69.68,107.62 69.68,101.02 71.02,99.68 71.02,95.24 69.34,93.56 69.34,88.86 82.9,75.3 v82.9,64.34
  Bottom 0.152: R54.2 8,120.92 8.18,120.92 I/P.SW1 8.26,120.88 8.44,120.7 20.5,120.7 30.1,111.1 64.84,111.1 68.14,107.8 v69.5,107.8 | v120.3,58.1 119.5,58.9 96.78,58.9 92.82,62.86 #9.SW1 84.3,62.94 v82.9,64.34 | U$21.D 163.8,22.92 136.84,22.92 136.8,22.98 132.52,27.26 v132.5,27.26
K12  (via drill 0.3)
  Top 0.152: CLR.SW1 40.3,41.26 v39.06,42.5 39.1,42.56 39.1,46.48 v43.44,50.82 | v104.32,54.02 108.44,58.14 108.44,63.52 ODU4.SW1
  Bottom 0.152: v39.06,42.5 39.08,42.5 R49.2 | v104.32,54.02 102.38,52.08 44.7,52.08 v43.44,50.82
K13  (via drill 0.3)
  Top 0.152: v61.1,45.76 60.24,44.9 60.24,42.94 #0.SW1
  Bottom 0.152: R51.2 62.34,40.88 #0.SW1 | v61.1,45.76 61.32,45.54 105.92,45.54 ODU5.SW1
K14  (via drill 0.3)
  Top 0.152: v83.44,42.96 84.3,42.1 ENT.SW1 84.36,41.9 91.28,41.9 94.72,45.34 94.72,72.94 v101,79.22
  Bottom 0.152: v83.44,42.96 84,42.96 R53.2 | EMCON.SW1 163.18,98.28 160.76,98.28 155.76,93.28 155.48,93.28 154.36,92.16 154.36,90.92 112.7,90.92 v101,79.22
KS_1_0  (via drill 0.3)
  Top 0.152: v27.64,25.02 27.64,25.8 D1.3 | v38.7,25.04 46.78,33.12 46.78,43.3 46.68,43.4 CLR.SW2 46.66,43.48 #7.SW2 46.68,65.48 46.78,65.58 46.78,87.3 46.72,87.36 #4.SW2 #1.SW2 46.74,109.42 #2.SW2 68.66,109.34 68.66,87.48 #5.SW2 68.66,65.48 #8.SW2 #0.SW2 | #6.SW2 #3.SW2 | ENT.SW2 90.78,43.52 90.78,65.3 #9.SW2
  Bottom 0.152: v27.64,25.02 27.66,25.04 v38.7,25.04 | #9.SW2 #8.SW2 | #6.SW2 #5.SW2
KS_1_1  (via drill 0.3)
  Top 0.152: 21.17,78.79 25.46,70.5 D2.6 | 21.17,78.79 v25.76,79.38 | I/P.SW2 14.34,123.24 14.34,106.68 4.56,96.9 4.56,93.86 6.52,91.9 SW1.C$1 6.58,91.84 6.58,89.78 6.62,89.72 8.64,87.7 8.64,87.32 17.14,78.82 21.1,78.82 21.17,78.79 | ODU5.SW2 114.66,45.94 114.66,66.18 ODU4.SW2 114.66,66.28 114.66,86.68 ODU3.SW2 114.58,86.88 114.66,86.96 114.66,92.8 | ODU1.SW2 ODU2.SW2 114.56,107.74 114.66,107.64 114.66,92.8 | v114.6,92.8 114.66,92.8
  Bottom 0.152: v25.76,79.38 25.78,79.38 40.18,93.78 ADF.P2 40.26,93.76 41.22,92.8 v114.6,92.8 | EMCON.SW2 164.58,107.8 ODU2.SW2
KS_1_2  (via drill 0.3)
  Top 0.152: 21.96,26.4 24.74,29.18 24.74,29.32 25.84,29.32 26.54,30.02 26.54,30.42 D2.3 | 21.96,26.4 13,26.4 13,23.5 10.76,21.26 U$5.D | v24.04,24.12 24.04,24.3 22,26.34 21.96,26.4 | v37.6,22.02 A/P.SW2
  Bottom 0.152: U$21.E 168.76,19.46 147.74,19.46 146.28,18 CN2.P2 144.86,19.32 144.8,19.28 143.58,19.28 138.66,14.36 ON/OFF.SW2 138.52,14.34 BCN.SW2 122.98,14.34 107.56,14.34 D/L.SW2 107.48,14.34 92.02,14.34 ILS.SW2 76.46,14.34 TCN.SW2 76.38,14.34 60.92,14.34 IFF.SW2 A/P.SW2 45.24,14.38 | v24.04,24.12 27.22,20.94 27.28,20.98 28.32,22.02 v37.6,22.02
N$1  (via drill 0.3)
  Top 0.2: v12.68,128.58 C4.1
  Bottom 0.2: 13.38,134.74 13.38,129.68 U$7.21 13.36,129.58 13.36,129.26 v12.68,128.58 | 13.38,134.74 13.14,134.74 12.76,135.12 12.76,135.48 U$7.3 12.66,135.5 U$7.2 | 13.38,134.74 18.58,134.74 18.58,135.48 U$7.12
N$2
  Bottom 0.152: R9.2 13.98,27.12 13.98,24.66 U$4.BLUE
N$5  (via drill 0.3)
  Top 0.152: v33.56,127.42 v32.46,128.52 | v109.28,129.26 v107.5,127.48
  Bottom 0.152: v32.46,128.52 18.12,128.52 17.54,129.1 17.3,129.1 U$7.15 | v33.56,127.42 33.62,127.48 v107.5,127.48 | v109.28,129.26 111.44,131.42 74HC138.1
N$6  (via drill 0.3)
  Top 0.152: v109.06,130.32 v106.76,128.02
  Bottom 0.152: v106.76,128.02 106.54,127.8 79.98,127.8 79.82,127.96 18,127.96 17,128.96 16.66,128.96 U$7.16 | v109.06,130.32 110.18,131.44 74HC138.2
N$7  (via drill 0.3)
  Top 0.152: v21.98,130.94 BLANK.1
  Bottom 0.152: v21.98,130.94 14.06,130.94 14.06,129.68 U$7.20
N$8  (via drill 0.3)
  Top 0.152: v107.8,130.32 v104.42,126.94
  Bottom 0.152: v104.42,126.94 85.1,126.94 85.04,126.88 16.58,126.88 16.58,128.6 16,129.18 U$7.17 | v107.8,130.32 108.9,131.42 74HC138.3
N$9  (via drill 0.3)
  Top 0.152: v101.06,135.46 96.86,131.26 96.86,126.18 86.94,116.26 v86.94,114.94
  Bottom 0.152: v101.06,135.46 103.08,135.46 103.08,135.94 103.82,136.68 74HC138.10 | v86.94,114.94 86.18,114.18 82.3,114.18 DIS3.2 80.66,115.76 78.2,115.76 DIS3.1
N$10  (via drill 0.3)
  Top 0.152: v115.2,73.58 v116.28,74.66
  Bottom 0.152: v116.28,74.66 119.66,78.04 154.34,78.04 SV2.20 | v115.2,73.58 114.98,73.8 78.7,73.8 77.6,74.9 31.28,74.9 31.22,74.86 24.04,67.68 17.46,67.68 14.6,64.82 C9.1 14.52,62.5 VOL1.B
N$11  (via drill 0.3)
  Top 0.152: v103.82,133.22 97.76,127.16 v97.76,125.86
  Bottom 0.152: v103.82,133.22 74HC138.7 | v97.76,125.86 91.7,119.8 33.98,119.8 29.94,115.76 DIS1.2 29.86,115.76 27.4,115.76 DIS1.1
N$13  (via drill 0.3)
  Top 0.152: v73.66,136 68.92,131.26 68.92,129.34 55.34,115.76 DIS2.2 55.26,115.76 52.8,115.76 DIS2.1
  Bottom 0.152: v73.66,136 101.88,136 102.56,136.68 74HC138.9
N$14  (via drill 0.3)
  Top 0.152: v105.74,135.4 107.22,135.4 108.06,136.24 130.46,136.24 130.46,116.02 ODU_DSP_1.2
  Bottom 0.152: v105.74,135.4 105.74,136.06 105.12,136.68 74HC138.11 | ODU_DSP_1.1 129.54,115.12 ODU_DSP_1.2
N$15  (via drill 0.3)
  Top 0.152: v131,134.78 130.78,134.56 130.78,112.84 130.46,112.52 130.46,95.52 ODU_DSP_2.2
  Bottom 0.152: v131,134.78 127.54,138.24 107.12,138.24 107.12,137.44 74HC138.12 | ODU_DSP_2.1 129.54,94.62 ODU_DSP_2.2
N$16  (via drill 0.3)
  Top 0.152: v107.66,135.08 109.82,132.92 109.82,123.58 109.66,123.42 109.66,105.94 109.7,105.9 109.7,103.28 109.66,103.24 109.66,84.94 109.7,84.9 109.7,82.28 109.66,82.24 109.66,79.24 112.2,76.7 v112.2,75.88
  Bottom 0.152: v107.66,135.08 107.66,136.68 74HC138.13 | v112.2,75.88 113.96,74.12 127,74.12 ODU_DSP_3.1 127.08,74.12 129.54,74.12 ODU_DSP_3.2
N$17  (via drill 0.3)
  Top 0.152: v124.52,134.78 127.92,131.38 127.92,54.52 | ODU_DSP_4.1 127.92,54.52 | ODU_DSP_4.2 129.54,53.62 128.68,54.48 127.98,54.48 127.92,54.52
  Bottom 0.152: v124.52,134.78 121.38,137.92 109.66,137.92 109.66,137.44 74HC138.14
N$18  (via drill 0.3)
  Top 0.152: v110.2,134.78 111.66,133.32 111.66,132.82 119.76,124.72 119.76,40.18 126.82,33.12 127,33.12 ODU_DSP_5.1
  Bottom 0.152: v110.2,134.78 110.2,136.68 74HC138.15 | ODU_DSP_5.2 129.54,33.12 ODU_DSP_5.1
N$19  (via drill 0.3)
  Top 0.152: ODU_DSP_5.6 139.7,33.12 138.82,34 138.82,52.72 ODU_DSP_4.6 139.68,53.68 138.82,54.54 138.82,73.22 ODU_DSP_3.6 139.68,74.18 138.82,75.04 138.82,93.72 ODU_DSP_2.6 139.68,94.68 138.82,95.54 138.82,114.22 ODU_DSP_1.6 | v26.26,130.18 36.64,119.8 40.08,119.8 40.08,115.76 DIS1.6 40.12,115.68 40.12,114.18 63.92,114.18 DIS2.6 | v93.04,113.6 DIS3.6
  Bottom 0.152: DIS2.6 65.5,115.76 67.04,117.3 89.34,117.3 90.88,115.76 DIS3.6 | v26.26,130.18 20.2,136.24 17.96,136.24 U$7.11 | ODU_DSP_1.6 137.9,113.3 96.34,113.3 96.04,113.6 v93.04,113.6
N$22
  Top 0.152: SV2.24 155.9,84.68 161.4,90.18 161.4,111.76 BRT.A
  Bottom 0.152: C3.1 165.54,118.52 165.54,115.88 165.5,115.88 BRT.A
N$29
  Bottom 0.152: R7.2 9.84,24.66 U$4.GREEN
N$32
  Bottom 0.152: U$11.RED R12.2
N$33
  Bottom 0.152: U$11.GREEN 166,26.86 R11.2
N$34
  Bottom 0.152: U$11.BLUE 170,26.84 R10.2
N$36
  Bottom 0.152: R5.2 7.88,27.12 7.88,24.66 U$4.RED
N$41
  Bottom 0.152: TP4.TP 162.64,28.78 R12.1
N$43
  Bottom 0.152: TP2.TP 6.14,29.02 7.86,29.02 R5.1
N$46
  Bottom 0.152: TP1.TP 15.68,29.04 R9.1
N$49
  Bottom 0.152: TP3.TP 171.46,28.76 R10.1
N$60
  Bottom 0.152: VOL2.A 165.36,62.5 165.36,64.7 C5.1 165.3,64.78 164.36,64.78 164.36,71.38 163.74,72 160.94,72 SV2.18
N$65
  Bottom 0.152: C7.1 170.44,62.5 VOL2.B 170.38,62.46 168.68,60.76 159.9,60.76 159.9,70.5 SV2.16
N$153  (1 unrouted)
ROW_K_#1_0  (via drill 0.3)
  Top 0.152: v20.3,28.84 14.12,35.02 v14.12,50.22 | v34.18,74.34 34.18,80.86 43.14,89.82 43.14,98.96 #1.LED_ANODE | v141.72,63.1 140.98,63.84 v140.98,116.54 | v109.12,116.1 v93.5,100.48
  Bottom 0.152: v20.3,28.84 24.4,28.84 25.32,29.76 33.18,29.76 33.54,29.4 U$31.25 | 12.09,52.25 11.18,53.16 CHANNEL1.1 | 12.09,52.25 v14.12,50.22 | 12.09,52.25 v34.18,74.34 | v141.72,63.1 146.56,58.26 156.54,58.26 CHANNEL2.1 | v140.98,116.54 140.48,117.04 116.72,117.04 116.26,116.58 111.8,116.58 110.74,117.64 ODU1.LED_ANODE 110.66,117.64 v109.12,116.1 | v93.5,100.48 93.34,100.64 44.24,100.64 #1.LED_ANODE
ROW_K_#1_1  (via drill 0.3)
  Top 0.152: A/P.LED_ANODE 40.42,5.24 40.42,9.76 40.46,9.8 40.46,12.4 36.12,16.74 36.12,29.62 v35.12,30.62 35.08,30.68 34.52,31.24 34.52,50.48 v34.18,50.82 | v123.62,104.54 123.62,120.24 D11.A | v61.42,57.28 63.78,59.64 63.78,62.2 63.82,62.24 63.82,76.76 63.78,76.8 63.78,84.2 64.84,85.26 64.84,99.24 #2.LED_ANODE
  Bottom 0.152: v35.12,30.62 33.58,30.62 U$31.24 | CHANNEL1.18 20.7,50.82 v34.18,50.82 34.24,50.86 40.88,57.5 61.2,57.5 v61.42,57.28 | CHANNEL2.18 171.54,55.96 171.54,90.6 171.36,90.6 170.34,91.62 170.34,100.32 165.28,100.32 161.62,103.98 124.2,103.98 123.68,104.5 v123.62,104.54 123.48,104.4 120.9,104.4 115.24,98.74 111.82,98.74 ODU2.LED_ANODE 110.68,97.6 109.66,96.58 67.52,96.58 #2.LED_ANODE
ROW_K_#1_2  (via drill 0.3)
  Top 0.152: v27.78,32.08 27.78,34.16 29.14,35.52 R1.2 29.1,35.6 29.1,45.64 v27.98,46.76 | v31.38,31.92 v31.38,19.28 31.38,13.2 v32.72,11.86 | v112.5,54.02 111.8,54.72 111.8,58.12 109.66,60.26 109.66,63.12 110.72,64.18 110.72,76.64 ODU3.LED_ANODE 110.66,76.68 109.82,76.68 105.4,81.1 105.4,82.92 v91.2,97.12 | v90.24,50.78 81.52,42.06 81.52,37.88 81.48,37.82 73.54,29.88 73.54,13.16 71.52,11.14 71.52,7.72 62.76,7.72 61.67,8.81 IFF.LED_ANODE
  Bottom 0.152: v27.78,32.08 27.92,31.94 31.38,31.94 | 31.38,31.94 33.54,31.94 U$31.23 | v27.98,46.76 19.68,46.76 CHANNEL1.16 | v31.38,19.28 31.38,17.6 | IFF.LED_ANODE 57.02,4.18 54.62,6.58 38.08,6.58 38.02,6.62 32.78,11.86 v32.72,11.86 | v31.38,31.92 31.38,31.94 | CHANNEL2.16 176.02,49.74 176.02,52.06 114.46,52.06 v112.5,54.02 112.44,53.98 110.22,51.76 91.22,51.76 v90.24,50.78 | v91.2,97.12 88.98,97.12 #3.LED_ANODE
ROW_K_#1_3  (via drill 0.3)
  Top 0.152: D9.A 123.96,99.4 v123.96,59.28 124,59.22 124,49.44 v131.38,42.06 | v34.88,106.34 40.9,100.32 43.94,100.32 43.94,85.46 41.78,83.3 41.78,78.32 #4.LED_ANODE 42.84,77.18 41.82,76.16 41.82,60.86 41.78,60.82 41.78,57.84 43.98,55.64 43.98,53.86 | v24.9,33.92 CHANNEL1.13 | 36.39,30.83 35.12,32.1 v35.12,33.16 | 36.39,30.83 36.44,30.78 36.44,24.5 42.26,24.5 42.3,24.44 42.3,19.48 46.76,15.02 46.8,14.96 46.8,13.52 55.58,4.74 55.58,3.1 71.52,3.1 TCN.LED_ANODE | 43.98,53.86 43.98,48.42 41.82,46.26 41.82,38.86 36.44,33.48 36.44,30.88 36.39,30.83 | v44.04,53.86 43.98,53.86
  Bottom 0.152: v123.96,59.28 121.92,57.24 111.82,57.24 ODU4.LED_ANODE 110.66,56.18 109.6,57.24 103.8,57.24 102.88,56.32 91.48,56.32 90.48,55.32 90.48,53.86 v44.04,53.86 | v131.38,42.06 172.74,42.06 CHANNEL2.13 | v34.88,106.34 34.88,108.08 R56.1 | v24.9,33.92 32.82,33.92 U$31.22 33.62,33.16 v35.12,33.16
ROW_K_#1_4  (via drill 0.3)
  Top 0.152: ILS.LED_ANODE 89.2,3.1 105.16,3.1 105.16,6.14 108.52,9.5 108.52,13.22 110.72,15.42 110.72,35.64 ODU5.LED_ANODE | v59.52,102.54 59.52,81.7 62.37,78.85 | 62.37,78.85 62.96,78.26 v63.24,78.26 | v55.04,34.88 59.26,39.1 59.26,57.92 59.04,58.14 59.04,75.52 62.37,78.85
  Bottom 0.152: CHANNEL2.10 172.74,34.44 147.94,34.44 147.34,35.04 116.72,35.04 116.26,34.58 111.8,34.58 110.74,35.64 ODU5.LED_ANODE 110.66,35.64 109.6,34.58 107.06,34.58 106.8,34.84 55.1,34.84 v55.04,34.88 34,34.88 33.62,34.5 U$31.21 24.28,34.46 23.54,33.72 19.24,33.72 CHANNEL1.10 | v59.52,102.54 R57.1 | v63.24,78.26 64.24,77.26 64.84,77.26 #5.LED_ANODE
ROW_K_#1_5  (via drill 0.3)
  Top 0.152: CHANNEL2.9 166.72,37.9 EMCON.LED_ANODE | v69.88,93.34 85.96,77.26 86.84,77.26 #6.LED_ANODE | v102.66,78.26 102.66,11.18 102.62,11.14 102.62,5.24 D/L.LED_ANODE | v31.38,94.32 v31.38,37.2
  Bottom 0.152: 31.38,36.32 4.54,36.32 3.98,35.76 3.98,32.84 CHANNEL1.9 | 31.38,36.32 32.96,36.32 U$31.20 | v69.88,93.34 50.66,93.34 48.7,95.3 R59.1 48.64,95.36 47.54,96.46 44.96,96.46 44.82,96.32 33.38,96.32 v31.38,94.32 | 102.66,78.32 87.92,78.32 #6.LED_ANODE | 102.66,78.32 116.26,78.32 116.62,78.68 120.62,78.68 D7.A 122.46,80.5 125.08,83.12 158.18,83.12 EMCON.LED_ANODE | v102.66,78.26 102.66,78.32 | v31.38,37.2 31.38,36.32
ROW_K_#1_6  (via drill 0.3)
  Top 0.152: v133.2,35.58 133.04,35.42 133.04,23.86 133,23.8 133,18.84 122.8,8.64 122.76,8.58 122.76,7.7 BCN.LED_ANODE | v37.42,79.38 37.52,79.28 37.52,59.7 41.96,55.26 | 41.96,55.26 #7.LED_ANODE | v36.2,36.72 37.52,38.04 37.52,50.8 41.92,55.2 41.96,55.26 | v34.18,102.54 36.24,100.48 v36.24,89.06
  Bottom 0.152: CHANNEL2.8 161.44,35.58 v133.2,35.58 133.14,35.62 132.02,36.74 89.84,36.74 88.78,35.68 37.26,35.68 36.26,36.68 v36.2,36.72 34.9,36.72 | v37.42,79.38 37.42,87.84 R55.1 37.38,87.92 v36.24,89.06 | 34.9,36.72 33.84,36.72 U$31.19 | 34.9,36.72 34.9,35.34 34.76,35.2 21.56,35.2 20.8,34.44 6.6,34.44 CHANNEL1.8 | v34.18,102.54 32.18,104.54 19.48,104.54 I/P.LED_ANODE
ROW_K_#1_7  (via drill 0.3)
  Top 0.152: v126.52,46.16 123.68,49 123.68,58.68 D5.A | v133.74,46.16 133.74,32.08 133.76,32.06 133.76,11.18 133.72,11.14 133.72,5.24 ON/OFF.LED_ANODE | v24.92,38.46 20.24,43.14 v20.24,43.16 | v58.58,87.18 58.72,87.04 v58.72,56.96 58.68,56.9 58.68,45.9 v55.04,42.26
  Bottom 0.152: v126.52,46.16 126.74,45.94 133.74,45.94 | 133.74,45.94 161.24,45.94 CHANNEL2.4 | 133.74,45.94 v133.74,46.16 | v24.92,38.46 33.36,38.46 U$31.18 33.62,38.24 33.8,38.06 37.16,38.06 38.42,36.8 39.66,36.8 41.88,39.02 41.88,41.58 54.36,41.58 v55.04,42.26 | v20.24,43.16 18.8,44.6 6.6,44.6 CHANNEL1.4 | v58.58,87.18 R58.1 | v58.72,56.96 59.36,56.32 63.78,56.32 64.84,55.26 #8.LED_ANODE 64.92,55.3 66.26,56.64 102.76,56.64 103.68,57.56 120.84,57.56 120.84,58.4 D5.A
ROW_K_#1_8  (via drill 0.3)
  Top 0.152: v88.08,49.38 86.86,50.6 #9.LED_ANODE | v31.98,40.66 31.98,49.02 | 31.98,49.02 v31.98,95.72 | v31.92,49.02 31.98,49.02
  Bottom 0.152: CHANNEL2.3 160.36,46.8 116.12,46.8 113.54,49.38 v88.08,49.38 88.02,49.34 86.76,48.08 32.88,48.08 31.98,48.98 v31.92,49.02 6.6,49.02 CHANNEL1.3 | v31.98,95.72 33.6,97.34 R60.1 | v31.98,40.66 33.08,39.56 33.54,39.56 U$31.17
ROW_K_#1_9  (via drill 0.3)
  Top 0.152: v155.38,43.44 159.98,48.04 159.98,48.96 CHANNEL2.2 | v37.4,54.78 35.12,52.5 35.12,49.68 | 35.12,49.68 v35.12,41.92 35.16,41.86 35.66,41.36 35.66,32.32 v35.9,32.08 | v35.06,49.68 35.12,49.68 | v92.06,31.86 v98.66,38.46 | v44.46,31.86 43.08,33.24 CLR.LED_ANODE
  Bottom 0.152: v155.38,43.44 126.36,43.44 122.4,39.48 D3.A 122.34,39.42 121.32,38.4 98.72,38.4 v98.66,38.46 | v37.4,54.78 R50.1 | v35.12,41.92 34.02,40.82 U$31.16 | v35.06,49.68 6.6,49.68 CHANNEL1.2 | v35.9,32.08 41.68,32.08 CLR.LED_ANODE | v44.46,31.86 v92.06,31.86
ROW_K_#1_10  (via drill 0.3)
  Top 0.152: v24.92,41.96 22.28,44.6 16.68,44.6 16.68,48.96 CHANNEL1.17 | v59.58,58.36 61.24,56.7 61.24,50.24 | 61.24,50.24 61.24,47.78 63.82,45.2 63.82,38.86 63.78,38.82 63.78,34.32 64.84,33.26 #0.LED_ANODE | v61.3,50.24 61.24,50.24
  Bottom 0.152: v24.92,41.96 33.42,41.96 U$31.15 | v59.58,58.36 59.52,58.36 59.52,65.74 R52.1 | CHANNEL2.17 173.4,49.68 148.38,49.68 147.82,50.24 v61.3,50.24 61.24,50.28 18.7,50.28 CHANNEL1.17
ROW_K_#1_11  (via drill 0.3)
  Top 0.152: CHANNEL1.15 20.02,47.2 20.02,55.72 19.98,55.78 19.98,59.76 v4.52,75.22 | v96.24,39.22 91.34,34.32 86.86,34.32 ENT.LED_ANODE
  Bottom 0.152: R54.1 5.14,97.48 4.52,96.86 v4.52,75.22 | CHANNEL1.15 19.1,45.54 22.54,42.1 U$31.14 22.62,42.12 25.72,45.22 90.98,45.22 96.2,40 96.2,39.28 v96.24,39.22 108.44,39.22 108.44,40.48 111.94,43.98 172.78,43.98 CHANNEL2.15
ROW_K_#1_12  (via drill 0.3)
  Top 0.152: v44.62,48.62 42.36,46.36 v42.36,44.68
  Bottom 0.152: CHANNEL1.14 20.54,40.82 22.48,40.82 U$31.13 23.02,40.82 24.82,42.62 36.36,42.62 R49.1 37.48,43.68 38.6,44.8 42.24,44.8 v42.36,44.68 | v44.62,48.62 60.44,48.62 61.74,49.92 147.7,49.92 148.26,49.36 162.42,49.36 164.64,47.14 176.02,47.14 176.02,44.66 CHANNEL2.14
ROW_K_#1_13  (via drill 0.3)
  Top 0.152: v157.58,44.52 CHANNEL2.6 | v60.78,44.68 v62.18,46.08
  Bottom 0.152: CHANNEL1.6 6.6,39.52 22.48,39.52 U$31.12 23.1,39 36.32,39 39.7,42.38 40.94,42.38 41.42,41.9 47.28,41.9 48.18,42.8 58.4,42.8 R51.1 59.58,43.92 60.02,43.92 v60.78,44.68 | v157.58,44.52 157.36,44.3 109.3,44.3 107.52,46.08 v62.18,46.08
ROW_K_#1_14
  Bottom 0.152: CHANNEL1.7 6.6,38.86 21.96,38.86 22.5,38.32 U$31.11 23.08,37.74 35.94,37.74 37.68,36 74.2,36 R53.1 81.92,43.62 83.12,42.42 84.9,42.42 85.42,41.9 91.78,41.9 95.76,37.92 CHANNEL2.7
ROW_K_#1_15  (via drill 0.3)
  Top 0.152: v159.24,45.4 CHANNEL2.5
  Bottom 0.152: 3.98,43 3.98,37.54 4.54,36.98 22.52,36.98 U$31.10 | CHANNEL1.5 3.98,43 | v159.24,45.4 159.02,45.62 116.86,45.62 115.16,47.32 29.5,47.32 28.4,46.22 19.72,46.22 19.46,46.48 4.54,46.48 3.98,45.92 3.98,43

## Text on the board
Top: (C) NEIL LARMOUR 2018 | DCS F/A-18C HORNET UFC V2
Bottom: DCS F/A-18C HORNET UFC V2 | (C) NEIL LARMOUR 2018
tNames: DCS F/A-18C HORNET UFC V2 / (C) NEIL LARMOUR 2018
bNames: DCS F/A-18C HORNET UFC V2 / (C) NEIL LARMOUR 2018